# EAGLE board module_alu1_ctrl (EAGLE 6.5.0)
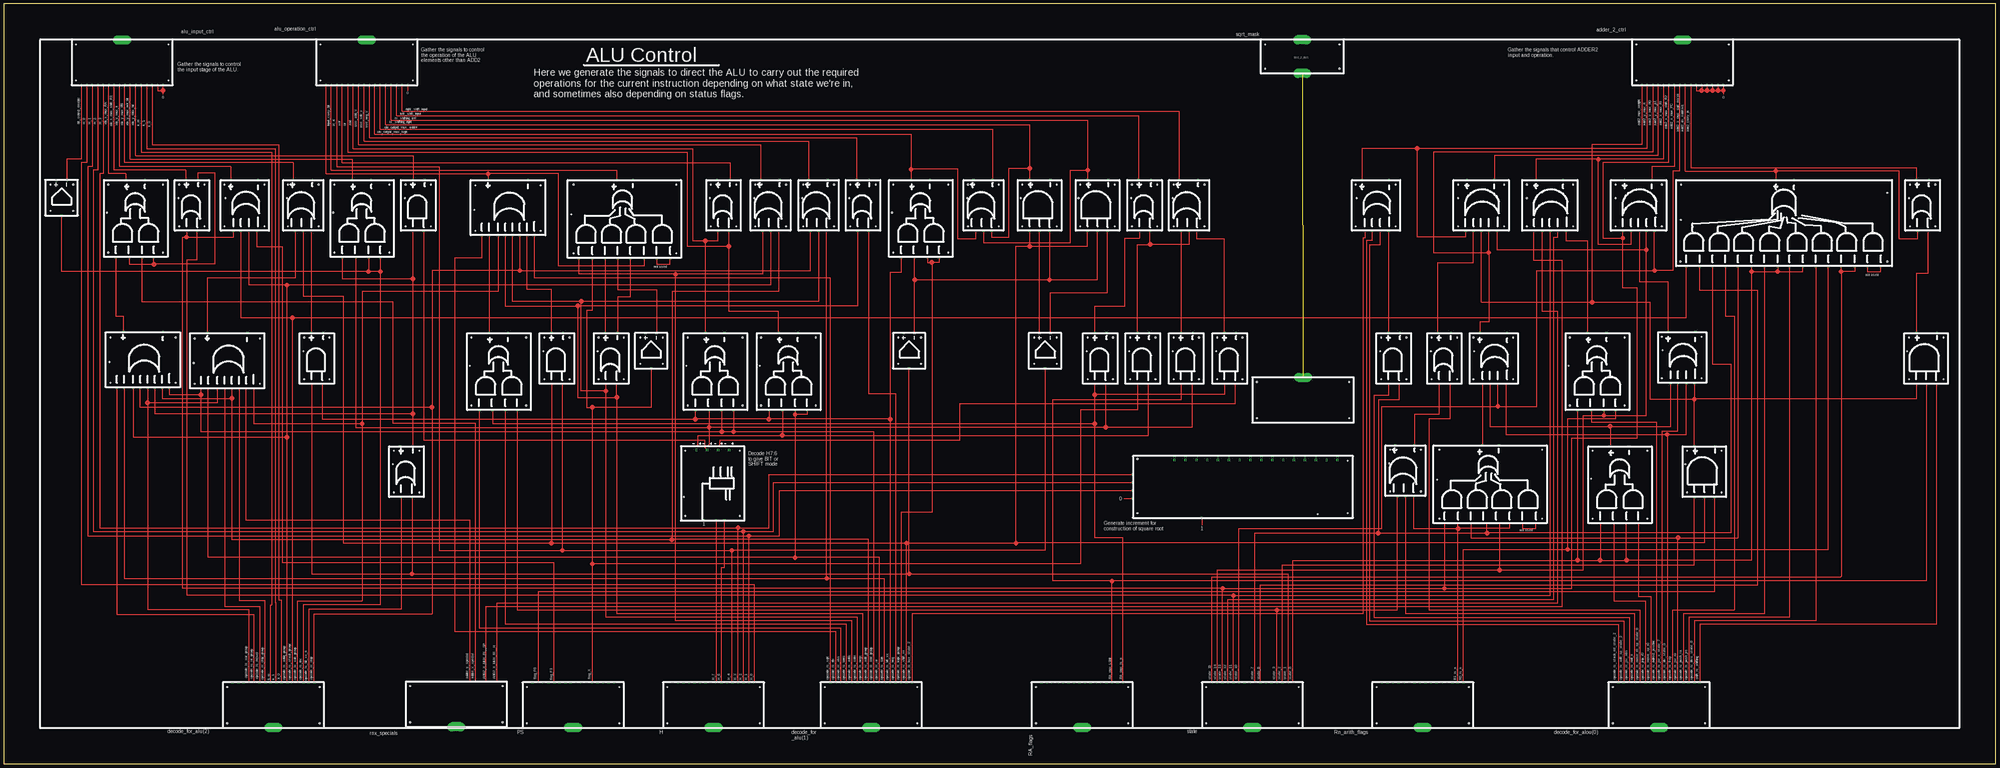
[diagram p14: board, top side]
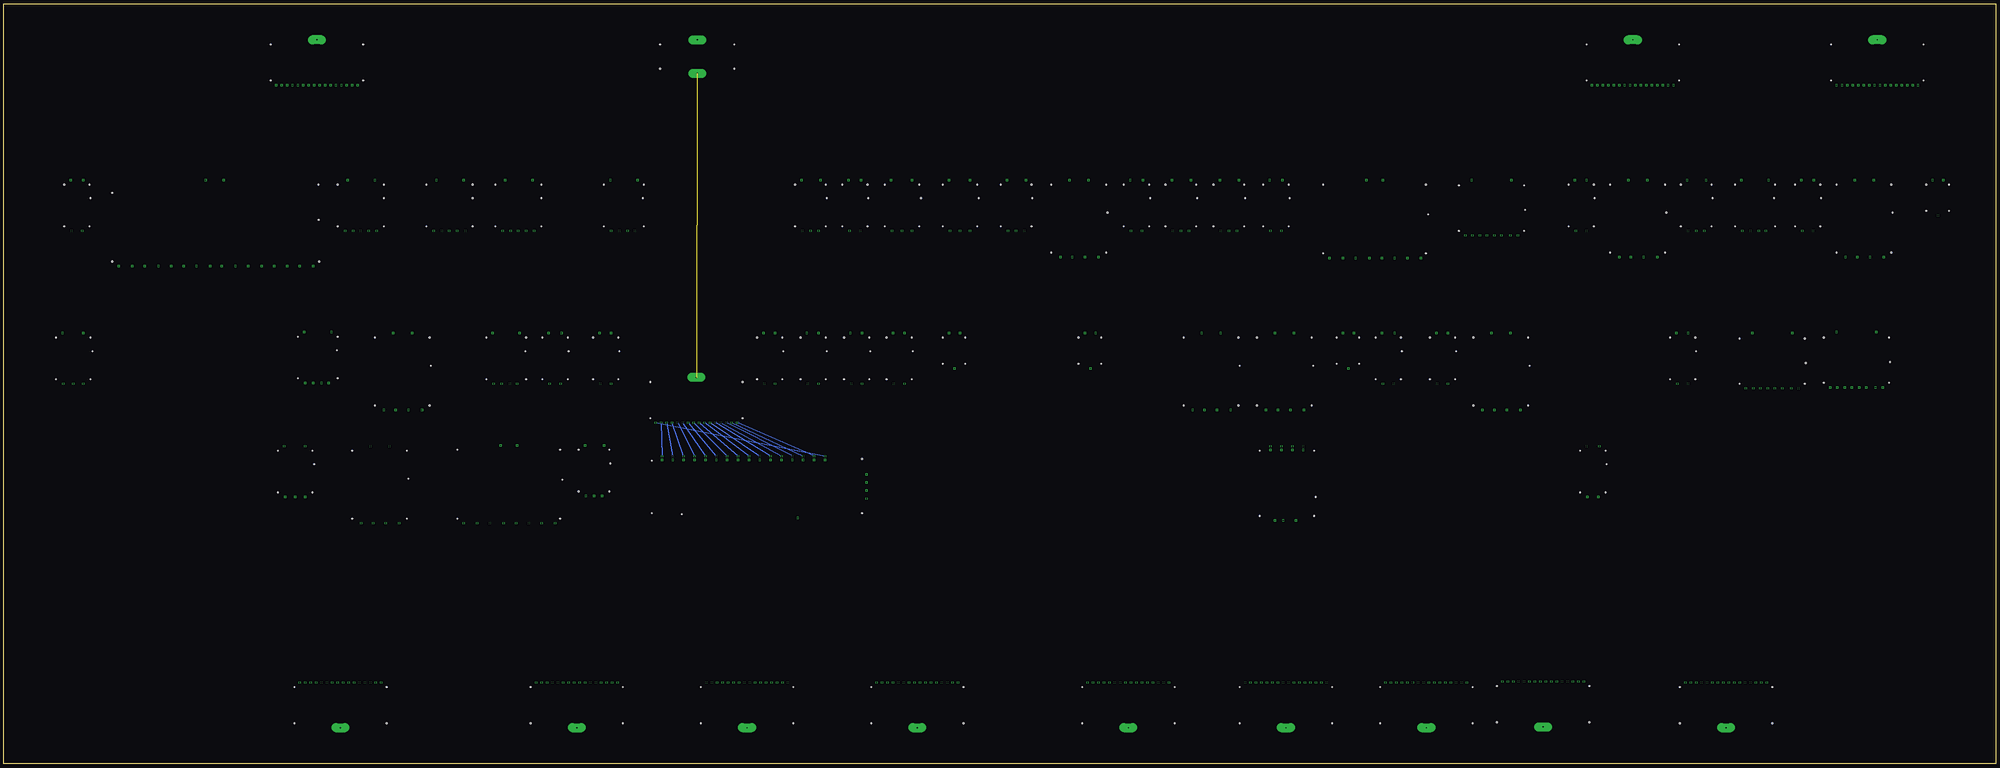
[diagram p15: board, bottom side, seen from below]

Size 1397 x 533.4 mm. Coordinates in mm from the lower left corner, seen from the top.
Outline: 0,0 1397,0 1397,533.4 0,533.4 0,0
Copper layers (1*16): Top 0.035mm / dielectric 1.5mm / Bottom 0.035mm
Design rules "default": minimum track width 10mil, minimum drill 24mil, track to track 8mil, track to pad 8mil, pad to pad 8mil, via to via 8mil, smd to smd 8mil, copper to edge 40mil, drill to drill 8mil, minimum pad ring 10mil, minimum via ring 8mil, stop-mask expansion 4mil, vias tented up to drill 0mil, thermal gap 10mil
tKeepout: area 16.3,16.3 to 34.5,34.5; area 689.4,16.3 to 707.6,34.5; area 1362.5,16.3 to 1380.7,34.5; area 1362.5,498.9 to 1380.7,517.1; area 689.4,498.9 to 707.6,517.1; area 16.3,498.9 to 34.5,517.1

## Footprints (pad centres in the part's own frame; a part is rotated, then mirrored left to right if it is on the bottom)
BUS_SPLIT_DISPLAY = drill 0.8 pad 6.452 long: INPUT 0,15.24 | drill 0.8 square: P$1 -28.575,-16.51; P$2 -24.765,-16.51; P$3 -20.955,-16.51; P$4 -17.145,-16.51; P$5 -13.335,-16.51; P$6 -9.525,-16.51; P$7 -5.715,-16.51; P$8 -1.905,-16.51; P$9 1.905,-16.51; P$10 5.715,-16.51; P$11 9.525,-16.51; P$12 13.335,-16.51; P$13 17.145,-16.51; P$14 20.955,-16.51; P$15 24.765,-16.51; P$16 28.575,-16.51 | hole 0.6: -32.385,-13.335; -32.385,12.065; 32.385,12.065; 32.385,-13.335
3OR = drill 0.8 square: OUT_M 16.51,-6.985; OUT_P 16.51,6.35; P$1 -19.05,-6.35; P$2 -19.05,-0.635; P$3 -19.05,5.08 | hole 0.6: -15.875,-11.43; 13.335,-11.43; 13.335,10.16; -15.875,10.16; 3.81,10.795
2AND = drill 0.8 square: OUT_M 19.05,-4.445; OUT_P 19.05,3.81; P$1 -16.51,-3.81; P$2 -16.51,3.81 | hole 0.6: -13.335,8.89; 15.875,-8.89; -13.335,-8.89; 15.875,8.89; 6.35,9.525
2X2AND_OR = drill 0.8 square: OUT_M 27.94,-6.985; OUT_P 27.94,6.35; P$1 -26.035,-13.335; P$2 -26.035,-5.08; P$3 -26.035,3.81; P$4 -26.035,13.335 | hole 0.6: -22.86,18.733; 24.765,18.733; -22.86,-19.685; 24.765,-19.685; 5.08,19.685
8OR = drill 0.8 square: 1 -21.59,-17.78; 2 -21.59,-12.7; 3 -21.59,-7.62; 4 -21.59,-2.54; 5 -21.59,2.54; 6 -21.59,7.62; 7 -21.59,13.97; 8 -21.59,19.05; OUT_M 17.145,-13.335; OUT_P 17.145,14.605 | hole 0.6: -18.415,-22.225; 13.335,-22.225; 13.335,23.495; -18.415,23.495; -3.81,24.13
2OR = drill 0.8 square: OUT_M 17.78,-4.445; OUT_P 17.78,4.445; P$1 -17.78,-3.81; P$2 -17.78,3.81 | hole 0.6: -14.605,8.89; 14.605,-8.89; 14.605,8.89; -14.605,-8.89; 5.08,9.525
4X2AND_OR = drill 0.8 square: OUT_M 26.67,-6.985; OUT_P 26.67,4.445; P$1 -27.94,-33.02; P$2 -27.94,-23.495; P$3 -27.94,-14.605; P$4 -27.94,-5.08; P$5 -27.94,3.81; P$6 -27.94,12.7; P$7 -27.94,21.59; P$8 -27.94,31.115 | hole 0.6: -24.765,-37.465; 23.495,-37.465; 23.495,34.608; -24.765,34.608; 2.54,36.195
DECODER4 = drill 0.8 square: A0 -24.765,-7.62; A1 -24.765,-1.905; E -24.765,6.985; N0 24.765,-10.795; N1 24.765,-3.175; N2 24.765,4.445; N3 24.765,12.065; P0 27.305,-10.795; P1 27.305,-3.175; P2 27.305,4.445; P3 27.305,12.065 | hole 0.6: 24.13,19.685; -21.59,19.685; -21.59,-18.415; 24.13,-18.415; -8.255,20.955
1BUF = drill 0.8 square: IN -12.7,0; N 12.065,-3.81; P 12.065,3.81 | hole 0.6: -9.525,7.62; -9.525,-8.255; 8.89,-8.255; 8.89,7.62
4OR = drill 0.8 square: 1 -16.51,-8.255; 2 -16.51,-2.54; 3 -16.51,3.175; 4 -16.51,8.255; OUT_M 19.05,-8.89; OUT_P 19.05,10.16 | hole 0.6: -13.335,-13.335; 15.875,-13.335; 15.875,14.605; -13.335,14.605; 6.35,13.97
DECODER16 = drill 0.8 square: A0 -83.82,-8.255; A1 -83.82,-2.54; A2 -83.82,3.175; A3 -83.82,8.89; E -35.56,-21.59; N0 59.69,19.05; N1 52.07,19.05; N2 44.45,19.05; N3 36.83,19.05; N4 29.21,19.05; N5 21.59,19.05; N6 13.97,19.05; N7 6.35,19.05; N8 -1.27,19.05; N9 -8.89,19.05; N10 -16.51,19.05; N11 -24.13,19.05; N12 -31.75,19.05; N13 -39.37,19.05; N14 -46.99,19.05; N15 -54.61,19.05; P0 59.69,21.59; P1 52.07,21.59; P2 44.45,21.59; P3 36.83,21.59; P4 29.21,21.59; P5 21.59,21.59; P6 13.97,21.59; P7 6.35,21.59; P8 -1.27,21.59; P9 -8.89,21.59; P10 -16.51,21.59; P11 -24.13,21.59; P12 -31.75,21.59; P13 -39.37,21.59; P14 -46.99,21.59; P15 -54.61,21.59 | hole 0.6: 66.675,18.415; -80.645,19.685; -80.645,-18.415; 66.675,-18.415; 45.72,-19.05
3AND = drill 0.8 square: OUT_M 16.51,-7.62; OUT_P 16.51,6.985; P$1 -19.05,-6.985; P$2 -19.05,0; P$3 -19.05,6.985 | hole 0.6: -15.875,-12.065; 13.335,-12.065; 13.335,12.065; -15.875,12.065; 3.81,13.335
BUS2BUS = drill 0.8 pad 6.452 long: P$1 -1.27,12.7; P$2 -1.27,-10.795 | hole 0.6: -27.305,-7.62; -27.305,9.525; 24.765,9.525; 24.765,-7.62
5OR = drill 0.8 square: 1 -17.78,-10.795; 2 -17.78,-5.08; 3 -17.78,0; 4 -17.78,5.715; 5 -17.78,11.43; OUT_M 17.78,-8.89; OUT_P 17.78,10.16 | hole 0.6: -14.605,-15.875; 14.605,-15.875; 14.605,16.51; -14.605,16.51; 5.08,16.51
8X2AND_OR = drill 0.8 square: OUT_M 29.845,-8.89; OUT_P 29.845,3.81; P$1 -30.48,-69.85; P$2 -30.48,-60.325; P$3 -30.48,-51.435; P$4 -30.48,-41.91; P$5 -30.48,-33.02; P$6 -30.48,-24.13; P$7 -30.48,-15.24; P$8 -30.48,-5.715; P$9 -30.48,2.54; P$10 -30.48,12.065; P$11 -30.48,20.955; P$12 -30.48,30.48; P$13 -30.48,39.37; P$14 -30.48,48.26; P$15 -30.48,57.15; P$16 -30.48,66.675 | hole 0.6: -27.305,-74.295; 20.955,-74.295; 26.67,70.168; -27.305,70.802; 1.905,70.485

## Placement (x,y rotation side)
CMP1  BUS_SPLIT_DISPLAY  [BUS_SPLIT_DISPLAY]  995.04,40.64 180 top
CMP2  3OR  [3OR]  537.21,393.06 90 top
CMP3  2AND  [2AND]  387.99,283.21 90 top
CMP4  2X2AND_OR  [2X2AND_OR]  346.71,274.32 90 top
CMP5  8OR  [8OR]  354.33,392.43 90 top
CMP6  2OR  [2OR]  426.08,284.48 90 top
CMP7  4X2AND_OR  [4X2AND_OR]  434.34,382.9 90 top
CMP8  3OR  [3OR]  570.87,393.06 90 top
CMP9  2OR  [2OR]  602.62,391.8 90 top
CMP10  DECODER4  [DECODER4]  497.84,195.58 90 top
CMP11  2AND  [2AND]  798.83,283.21 90 top
CMP12  BUS_SPLIT_DISPLAY  [BUS_SPLIT_DISPLAY]  875.66,40.64 180 top
CMP13  BUS_SPLIT_DISPLAY  [BUS_SPLIT_DISPLAY]  497.84,40.64 180 top
CMP14  2X2AND_OR  [2X2AND_OR]  1116.96,274.32 90 top
CMP15  BUS_SPLIT_DISPLAY  [BUS_SPLIT_DISPLAY]  756.28,40.64 180 top
CMP16  2AND  [2AND]  768.99,283.21 90 top
CMP17  3OR  [3OR]  982.35,207.01 90 top
CMP18  2OR  [2OR]  800.1,391.8 90 top
CMP19  2AND  [2AND]  859.79,283.21 90 top
CMP20  2AND  [2AND]  219.71,283.21 90 top
CMP21  BUS_SPLIT_DISPLAY  [BUS_SPLIT_DISPLAY]  399.42,40.64 180 top
CMP22  BUS_SPLIT_DISPLAY  [BUS_SPLIT_DISPLAY]  317.5,41.27 180 top
CMP23  2AND  [2AND]  829.31,283.21 90 top
CMP24  2OR  [2OR]  282.57,205.1 90 top
CMP25  1BUF  [1BUF]  635,290.19 90 top
CMP26  8OR  [8OR]  98.42,285.75 90 top
CMP27  2OR  [2OR]  132.08,391.8 90 top
CMP28  2X2AND_OR  [2X2AND_OR]  92.08,381.63 90 top
CMP29  8OR  [8OR]  157.48,285.12 90 top
CMP30  3OR  [3OR]  209.55,393.06 90 top
CMP31  4OR  [4OR]  169.54,390.52 90 top
CMP32  2AND  [2AND]  290.83,390.52 90 top
CMP33  2X2AND_OR  [2X2AND_OR]  250.82,381.63 90 top
CMP34  3OR  [3OR]  830.58,393.06 90 top
CMP35  DECODER16  [DECODER16]  875.66,194.31 0 top
CMP36  3AND  [3AND]  767.08,393.06 90 top
CMP37  3AND  [3AND]  726.44,393.06 90 top
CMP38  1BUF  [1BUF]  730.25,290.19 90 top
CMP39  BUS_CONSTRUCT_DISPLAY  [BUS_SPLIT_DISPLAY]  911.23,255.91 0 top
CMP40  BUS_2_BUS  [BUS2BUS]  909.32,497.2 180 top
CMP41  1BUF  [1BUF]  40.64,397.51 90 top
CMP42  2X2AND_OR  [2X2AND_OR]  498.48,274.32 90 top
CMP43  2X2AND_OR  [2X2AND_OR]  549.91,274.32 90 top
CMP44  2OR  [2OR]  504.82,391.8 90 top
CMP45  2X2AND_OR  [2X2AND_OR]  642.62,381.63 90 top
CMP46  3OR  [3OR]  686.43,393.06 90 top
CMP47  2AND  [2AND]  974.73,283.21 90 top
CMP48  2X2AND_OR  [2X2AND_OR]  1132.84,194.94 90 top
CMP49  4OR  [4OR]  962.66,390.52 90 top
CMP50  4OR  [4OR]  1045.21,283.21 90 top
CMP51  2OR  [2OR]  1010.28,284.48 90 top
CMP52  4X2AND_OR  [4X2AND_OR]  1041.4,196.85 90 top
CMP53  4OR  [4OR]  1177.29,283.85 90 top
CMP54  5OR  [5OR]  1036.32,391.8 90 top
CMP55  8X2AND_OR  [8X2AND_OR]  1246.51,379.73 90 top
CMP56  3AND  [3AND]  1192.53,206.38 90 top
CMP57  1BUF  [1BUF]  454.02,290.19 90 top
CMP59  3AND  [3AND]  1348.11,285.75 90 top
CMP60  5OR  [5OR]  1084.58,391.8 90 top
CMP61  2OR  [2OR]  1345.57,391.8 90 top
CMP62  5OR  [5OR]  1146.81,391.8 90 top
CMP65  BUS_CONSTRUCT_DISPLAY  [BUS_SPLIT_DISPLAY]  254.63,492.76 0 top
CMP66  BUS_CONSTRUCT_DISPLAY  [BUS_SPLIT_DISPLAY]  83.19,492.76 0 top
CMP67  BUS_CONSTRUCT_DISPLAY  [BUS_SPLIT_DISPLAY]  1177.29,492.76 0 top
CMP88  BUS_SPLIT_DISPLAY  [BUS_SPLIT_DISPLAY]  608.33,40.64 180 top
CMP92  BUS_SPLIT_DISPLAY  [BUS_SPLIT_DISPLAY]  1160.78,40.64 180 top
CMP94  BUS_SPLIT_DISPLAY  [BUS_SPLIT_DISPLAY]  189.23,40.64 180 top

## Tracks (layer width: path | path; a pad name or v marks a point on that pad's centre or on a via)
ADD1_CARRY_INPUT_BIT
  Top 0.61: CMP7.OUT_P 429.89,416.56 229.87,416.56 CMP65.P$2
ADD1_DO_SUBTRACT
  Top 0.61: 339.73,414.02 226.06,414.02 CMP65.P$1 | 339.73,414.02 CMP5.OUT_P | CMP7.P$3 448.94,349.25 389.25,349.25 389.25,414.02 339.73,414.02
ADD2_CARRY_IN
  Top 0.61: CMP61.OUT_P 1341.12,418.46 1183.01,418.46 CMP67.P$10
ADD2_DO_SUBTRACT
  Top 0.61: 1242.69,415.93 1179.19,415.93 CMP67.P$9 | 1242.69,415.93 CMP55.OUT_P | CMP61.P$2 1341.76,368.3 1329.06,368.3 1329.06,415.93 1242.69,415.93
ADD2_MUX_WEIGHT
  Top 0.61: CMP56.OUT_P 1185.55,255.91 | CMP54.3 1036.32,323.85 1113.79,323.85 | CMP59.P$3 1341.12,255.91 1185.55,255.91 | CMP53.1 1185.55,255.91 | 1113.79,323.85 1154.43,323.85 1154.43,255.91 1185.55,255.91 | CMP67.P$1 1148.71,434.34 1113.79,434.34 1113.79,323.85
ADD2_WEIGHT_BIT
  Top 0.61: CMP61.P$1 1349.38,344.17 1341.12,344.17 CMP59.OUT_P
ADD2_X_MUX_PC
  Top 0.61: CMP62.OUT_M 1155.7,419.1 1171.58,419.1 CMP67.P$7
ADD2_X_MUX_RI
  Top 0.61: 1118.23,424.18 1163.95,424.18 CMP67.P$5 | 1118.23,424.18 1074.42,424.18 CMP60.OUT_P | CMP62.4 1141.1,364.49 1118.23,364.49 1118.23,424.18
ADD2_X_MUX_RI__H
  Top 0.61: CMP22.P$1 346.07,113.03 1089.66,113.03 1089.66,317.5 1078.87,317.5 CMP60.4
ADD2_X_MUX_RI__SET_A
  Top 0.61: CMP60.1 1095.38,367.03 1110.62,367.03 CMP14.OUT_P
ADD2_X_MUX_RI__SP
  Top 0.61: CMP22.P$3 338.45,110.49 1092.84,110.49 1092.84,353.06 1073.15,353.06 CMP60.5
ADD2_X_ZERO
  Top 0.61: CMP62.3 1146.81,338.45 1167.13,338.45 CMP53.OUT_P
ADD2_Y_MUX_0
  Top 0.61: CMP51.OUT_P 1005.84,351.79 1030.61,351.79 CMP54.4
ADD2_Y_MUX_0__MUL
  Top 0.61: CMP51.P$2 1006.48,245.11 989.33,245.11 CMP17.OUT_M
ADD2_Y_MUX_H
  Top 0.61: 991.24,431.8 1152.53,431.8 CMP67.P$2 | 991.24,431.8 952.5,431.8 CMP49.OUT_P | CMP54.5 1024.89,369.57 991.24,369.57 991.24,431.8
ADD2_Y_MUX_H__JSR
  Top 0.61: CMP49.1 CMP47.OUT_P
ADD2_Y_MUX_P1
  Top 0.61: CMP54.OUT_M 1045.21,426.72 1160.14,426.72 CMP67.P$4
ADD2_Y_MUX_R0
  Top 0.61: 1041.4,358.77 1002.66,358.77 1002.66,429.26 1156.34,429.26 CMP67.P$3 | 1041.4,358.77 CMP54.2 | 1041.4,358.77 1041.4,309.88 1035.05,309.88 CMP50.OUT_P
ADD2_Y_MUX_R0__SET_A
  Top 0.61: CMP50.4 CMP52.OUT_P
ADDER_X_SPECIAL
  Top 0.61: CMP22.P$5 330.83,238.76 273.05,238.76 273.05,323.85 97.16,323.85 CMP28.P$2
ADDER_Y_SPECIAL
  Top 0.61: CMP22.P$6 327.02,170.81 170.18,170.81 CMP29.2
ALU1_OUTPUT_MUX_ADDER
  Top 0.61: CMP46.OUT_M 693.42,445.13 264.16,445.13 CMP65.P$11
ALU1_OUTPUT_MUX_LOGIC
  Top 0.61: 636.27,417.19 636.27,441.96 260.35,441.96 CMP65.P$10 | 636.27,417.19 CMP45.OUT_P | CMP46.P$3 681.36,368.3 669.29,368.3 669.29,417.19 636.27,417.19
ALU1_X_MUX_RA
  Top 0.61: CMP28.OUT_P 85.72,414.02 73.66,414.02 CMP66.P$6
ALU1_X_MUX_RA__SET_A
  Top 0.61: CMP28.P$4 78.74,314.32 83.82,314.32 CMP26.OUT_P
ALU1_X_MUX_SHIFT_R3
  Top 0.61: CMP27.OUT_P 127.64,416.56 77.47,416.56 CMP66.P$7
ALU1_X_MUX_SHIFT_R3_N
  Top 0.61: CMP27.OUT_M 136.53,414.65 147.96,414.65 147.96,350.52 105.41,350.52 | 105.41,350.52 CMP28.P$1 | CMP28.P$3 88.27,350.52 105.41,350.52
ALU1_Y_MUX_BIT
  Top 0.61: CMP32.OUT_P 287.02,426.72 92.71,426.72 CMP66.P$11
ALU1_Y_MUX_K
  Top 0.61: CMP31.OUT_P 159.38,419.1 81.28,419.1 CMP66.P$8
ALU1_Y_MUX_NOT_BIT
  Top 0.61: CMP33.OUT_P 244.47,424.18 88.9,424.18 CMP66.P$10
ALU1_Y_MUX_RB
  Top 0.61: CMP30.OUT_P 203.2,421.64 85.09,421.64 CMP66.P$9
ALU1_Y_MUX_RB_A
  Top 0.61: CMP30.P$3 204.47,341 142.88,341 CMP29.OUT_P
AND
  Top 0.61: 492.12,367.03 483.24,367.03 483.24,431.8 245.11,431.8 CMP65.P$6 | 492.12,367.03 501.01,367.03 CMP44.P$2 | CMP42.OUT_P 492.12,367.03
ARITH_RIGHT_INPUT
  Top 0.61: CMP19.OUT_P 855.98,368.3 836.93,368.3 CMP34.P$1
BIT_SELECT_ENABLE
  Top 0.61: CMP41.N 44.45,424.18 54.61,424.18 CMP66.P$1
BIT_SHIFT_MODE_CHANGE__ARITH
  Top 0.61: CMP10.P1 502.29,224.16 502.29,227.33 670.56,227.33 670.56,252.73 863.6,252.73 CMP19.P$1
BIT_SHIFT_MODE_CLEAR__ROTATE
  Top 0.61: CMP42.P$3 494.67,236.22 | 494.67,236.22 494.67,224.16 CMP10.P2 | CMP16.P$1 772.79,236.22 | 772.79,236.22 494.67,236.22 | CMP23.P$1 833.12,236.22 772.79,236.22 | CMP33.P$3 247.01,236.22 494.67,236.22
BIT_SHIFT_MODE_CLEAR__ROTATE_N
  Top 0.61: CMP10.N2 491.49,222.25 491.49,227.33 294.64,227.33 CMP32.P$1
BIT_SHIFT_MODE_SET__X_ROT
  Top 0.61: CMP10.P3 487.05,224.16 487.05,230.5 546.1,230.5 | 546.1,230.5 802.64,230.5 CMP11.P$1 | CMP43.P$3 546.1,230.5
BIT_XX_ACTION_CYCLE
  Top 0.61: CMP24.OUT_M 287.02,245.75 | 287.02,245.75 287.02,340.36 | 287.02,340.36 CMP32.P$2 | CMP26.3 106.05,245.75 287.02,245.75 | CMP33.P$4 237.49,340.36 287.02,340.36
BIT_XX_LOAD_CYCLE
  Top 0.61: CMP20.OUT_P CMP30.P$1
DO_SUBTRACT__SET_A
  Top 0.61: CMP5.7 CMP4.OUT_P
FLAG_F3
  Top 0.61: CMP21.P$12 386.08,140.97 195.58,140.97 195.58,362.58 177.8,362.58 CMP31.1
FLAG_F6
  Top 0.61: CMP56.P$1 1199.52,120.65 374.65,120.65 CMP21.P$15
FLAG_X
  Top 0.61: CMP7.P$7 412.75,318.13 408.94,318.13 408.94,250.19 412.75,250.19 | 412.75,250.19 412.75,140.34 | 412.75,140.34 CMP21.P$5 | CMP11.P$2 795.02,248.28 755.01,248.28 755.01,140.34 412.75,140.34 | CMP57.IN 454.02,250.19 412.75,250.19
FLAG_X_N
  Top 0.61: CMP7.P$5 430.53,332.74 457.83,332.74 CMP57.N
H_0
  Top 0.61: CMP66.P$2 58.42,421.64 54.61,421.64 54.61,125.73 526.41,125.73 CMP13.P$1
H_1
  Top 0.61: CMP66.P$3 62.23,419.1 59.05,419.1 59.05,160.02 522.61,160.02 | 522.61,160.02 544.2,160.02 544.2,191.77 CMP35.A1 | CMP13.P$2 522.61,160.02
H_2
  Top 0.61: CMP66.P$4 66.04,416.56 62.87,416.56 62.87,163.19 518.79,163.19 | 518.79,163.19 539.75,163.19 539.75,197.49 CMP35.A2 | CMP13.P$3 518.79,163.19
H_3
  Top 0.61: CMP66.P$5 69.85,414.02 67.31,414.02 67.31,165.74 514.99,165.74 | 514.99,165.74 536.58,165.74 536.58,203.2 CMP35.A3 | CMP13.P$4 514.99,165.74
H_4
  Top 0.61: CMP38.IN 730.25,149.86 510.54,149.86 | 510.54,149.86 510.54,57.78 CMP13.P$5 | CMP3.P$1 391.8,149.86 | 391.8,149.86 510.54,149.86 | CMP65.P$3 233.68,419.1 305.44,419.1 305.44,149.86 391.8,149.86
H_6
  Top 0.61: CMP13.P$7 503.56,137.79 505.46,137.79 CMP10.A0
H_7
  Top 0.61: CMP10.A1 CMP13.P$8
IS_SHIFTING_LEFT
  Top 0.61: 760.1,416.56 760.1,451.49 271.78,451.49 CMP65.P$13 | 760.1,416.56 CMP36.OUT_P | CMP46.P$2 687.07,365.76 748.03,365.76 748.03,416.56 760.1,416.56
IS_SHIFTING_RIGHT
  Top 0.61: 719.46,417.83 719.46,448.31 267.97,448.31 CMP65.P$12 | 719.46,417.83 CMP37.OUT_P | CMP46.P$1 692.78,369.57 704.85,369.57 704.85,417.83 719.46,417.83
JMP_R0_MOVE_SP_R0_STATE_0
  Top 0.61: CMP50.3 1042.04,236.85 1126.49,236.85 | 1126.49,236.85 CMP48.OUT_P | 1126.49,236.85 1169.04,236.85 CMP53.4
K_0
  Top 0.61: CMP66.P$14 104.14,434.34 193.04,434.34 193.04,114.94 194.94,114.94 CMP94.P$7
K_1
  Top 0.61: CMP66.P$13 100.33,431.8 190.5,431.8 190.5,113.03 191.13,113.03 CMP94.P$8
K_N
  Top 0.61: CMP66.P$12 96.52,429.26 187.96,429.26 187.96,111.76 187.32,111.76 CMP94.P$9
LEFT_SHIFT_INPUT
  Top 0.61: CMP18.OUT_P 795.65,454.66 275.59,454.66 CMP65.P$14
N$1
  Top 0.61: CMP7.P$2 457.83,350.52 467.36,350.52 CMP7.P$1
N$2
  Top 0.61: CMP35.E 840.11,167.64
N$4
  Bottom 0.254: CMP39.P$15 CMP35.P0
N$5
  Bottom 0.254: CMP39.P$14 CMP35.P1
N$6
  Bottom 0.254: CMP35.P2 CMP39.P$13
N$7
  Top 0.61: CMP35.A0 785.5,186.06
N$8
  Bottom 0.254: CMP39.P$12 CMP35.P3
N$9
  Bottom 0.254: CMP35.P4 CMP39.P$11
N$10
  Bottom 0.254: CMP39.P$10 CMP35.P5
N$11
  Bottom 0.254: CMP35.P6 CMP39.P$9
N$12
  Bottom 0.254: CMP39.P$8 CMP35.P7
N$13
  Bottom 0.254: CMP35.P8 CMP39.P$7
N$14
  Bottom 0.254: CMP39.P$6 CMP35.P9
N$15
  Bottom 0.254: CMP35.P10 CMP39.P$5
N$16
  Bottom 0.254: CMP39.P$4 CMP35.P11
N$17
  Bottom 0.254: CMP35.P12 CMP39.P$3
N$18
  Bottom 0.254: CMP39.P$2 CMP35.P13
N$19
  Bottom 0.254: CMP35.P14 CMP39.P$1
N$20
  Bottom 0.254: CMP39.P$16 CMP35.P15
N$21  (1 unrouted)
N$22
  Top 0.61: CMP66.P$16 111.76,472.44 | 111.76,472.44 111.76,469.9 | CMP66.P$15 107.95,472.44 111.76,472.44
N$24
  Top 0.61: CMP67.P$16 1205.87,472.44 | 1205.87,472.44 1205.87,469.9 | CMP67.P$11 1186.82,472.44 1190.62,472.44 | 1190.62,472.44 1194.43,472.44 | 1194.43,472.44 1198.24,472.44 | 1198.24,472.44 1202.06,472.44 | 1202.06,472.44 1205.87,472.44 | CMP67.P$15 1202.06,472.44 | CMP67.P$14 1198.24,472.44 | CMP67.P$13 1194.43,472.44 | CMP67.P$12 1190.62,472.44
N$25
  Top 0.61: 283.21,474.98 283.21,472.44
N$31
  Top 0.61: CMP55.P$2 1306.83,345.44 1316.36,345.44 CMP55.P$1
N$32
  Top 0.61: CMP52.P$2 1064.89,165.1 1074.42,165.1 CMP52.P$1
NEGATE_FOR_SHIFT
  Top 0.61: CMP3.OUT_P 384.18,332.74 367.03,332.74 CMP5.2
OPCODE_IS_ABS
  Top 0.61: CMP4.P$4 333.38,95.25 587.38,95.25 CMP88.P$14
OPCODE_IS_ADD_GROUP
  Top 0.61: CMP26.2 111.12,256.54 160.02,256.54 | CMP29.4 160.02,256.54 | 160.02,256.54 160.02,157.48 468.63,157.48 | CMP2.P$1 543.56,331.47 468.63,331.47 468.63,157.48 | CMP88.P$9 606.42,157.48 468.63,157.48
OPCODE_IS_ADD_SP_STATE_2
  Top 0.61: CMP49.2 965.2,363.86 957.58,363.86 957.58,100.33 1136.02,100.33 CMP92.P$15
OPCODE_IS_ADDQ_GROUP
  Top 0.61: CMP2.P$2 537.85,335.92 198.75,335.92 | 198.75,335.92 172.09,335.92 CMP31.2 | CMP26.6 90.81,229.24 198.75,229.24 | 198.75,229.24 198.75,335.92 | CMP94.P$6 198.75,229.24
OPCODE_IS_ADDX
  Top 0.61: CMP7.P$8 403.23,343.54 471.17,343.54 | CMP2.P$3 532.13,343.54 471.17,343.54 | CMP88.P$12 595,100.33 471.17,100.33 471.17,343.54
OPCODE_IS_AND_GROUP
  Top 0.61: CMP42.P$2 503.56,233.04 | 503.56,233.04 138.43,233.04 138.43,259.08 | 138.43,259.08 CMP29.8 | CMP26.1 116.2,259.08 138.43,259.08 | CMP88.P$8 610.24,233.04 511.81,233.04 | 511.81,233.04 503.56,233.04 | CMP42.P$1 511.81,233.04
OPCODE_IS_BIT_XX
  Top 0.61: CMP43.P$4 536.58,241.94 | 536.58,241.94 485.14,241.94 | 485.14,241.94 CMP42.P$4 | CMP45.P$4 629.28,344.81 621.66,344.81 621.66,241.94 | 621.66,241.94 536.58,241.94 | CMP20.P$1 223.52,241.94 485.14,241.94 | 621.66,241.94 CMP88.P$5
OPCODE_IS_BIT_XX_N
  Top 0.61: CMP24.P$2 278.76,108.58 214,108.58 CMP94.P$2
OPCODE_IS_BXX_STATE_2
  Top 0.61: CMP49.4 954.4,368.94 953.13,368.94 953.13,105.41 636.9,105.41 CMP88.P$1
OPCODE_IS_CMP
  Top 0.61: CMP5.3 361.95,346.07 | 361.95,346.07 565.78,346.07 CMP8.P$3 | 361.95,346.07 300.36,346.07 300.36,250.19 | 300.36,250.19 95.89,250.19 CMP26.5 | 300.36,250.19 300.36,105.41 217.81,105.41 CMP94.P$1
OPCODE_IS_CMP_GROUP
  Top 0.61: CMP29.3 165.1,114.3 183.51,114.3 CMP94.P$10
OPCODE_IS_DIV
  Top 0.61: CMP5.8 335.28,354.96 316.23,354.96 316.23,92.71 583.57,92.71 CMP88.P$15
OPCODE_IS_DIV_STATE_0
  Top 0.61: 1166.49,231.14 CMP92.P$7 | CMP50.1 1053.46,231.14 1166.49,231.14 | 1166.49,231.14 1179.83,231.14 CMP53.2
OPCODE_IS_DIVS_STATE_0
  Top 0.61: CMP55.P$6 1270.63,100.33 1185.55,100.33 CMP92.P$2
OPCODE_IS_INDIRECT_POSTINC
  Top 0.61: CMP14.P$3 1113.15,240.03 1158.88,240.03 CMP92.P$9
OPCODE_IS_INV
  Top 0.61: CMP33.P$2 255.91,345.44 | 255.91,345.44 40.64,345.44 CMP41.IN | CMP33.P$1 264.16,345.44 | 264.16,345.44 255.91,345.44 | 264.16,345.44 264.16,111.76 210.19,111.76 CMP94.P$3
OPCODE_IS_JMP_R0
  Top 0.61: CMP48.P$3 1129.03,114.3 1151.26,114.3 CMP92.P$11
OPCODE_IS_JSR_ABS
  Top 0.61: CMP47.P$2 970.91,258.44 960.75,258.44 960.75,102.87 1139.83,102.87 CMP92.P$14
OPCODE_IS_JSR_R0
  Top 0.61: CMP55.P$12 1216.03,158.75 1174.12,158.75 | CMP52.P$6 1028.7,158.75 1174.12,158.75 | CMP92.P$5 1174.12,158.75
OPCODE_IS_JSR_X_STATE_7
  Top 0.61: CMP92.P$8 1162.68,233.68 1174.12,233.68 CMP53.3
OPCODE_IS_LOGIC_GROUP
  Top 0.61: CMP45.P$2 647.7,351.79 650.88,351.79 | 650.88,351.79 650.88,176.53 629.28,176.53 CMP88.P$3 | CMP45.P$1 655.96,351.79 650.88,351.79
OPCODE_IS_MOVE_R0_SP_STATE_0
  Top 0.61: CMP51.P$1 1014.1,241.94 999.49,241.94 999.49,107.95 1147.44,107.95 CMP92.P$12
OPCODE_IS_MOVE_SP_R0
  Top 0.61: CMP48.P$1 1146.17,117.47 1155.07,117.47 CMP92.P$10
OPCODE_IS_MOVER
  Top 0.61: CMP29.5 154.94,110.49 179.71,110.49 CMP94.P$11
OPCODE_IS_MUL_N
  Top 0.61: CMP17.P$2 982.98,105.41 1143.63,105.41 CMP92.P$13
OPCODE_IS_MULS
  Top 0.61: CMP4.P$2 351.79,97.79 591.18,97.79 CMP88.P$13
OPCODE_IS_NEG
  Top 0.61: CMP9.P$1 606.42,259.71 625.48,259.71 CMP88.P$4
OPCODE_IS_NEGX
  Top 0.61: CMP5.5 351.79,321.31 402.59,321.31 | 402.59,321.31 402.59,257.18 429.89,257.18 | 429.89,257.18 CMP6.P$1 | CMP9.P$2 598.8,321.31 402.59,321.31 | 429.89,257.18 429.89,105.41 602.62,105.41 CMP88.P$10
OPCODE_IS_OR
  Top 0.61: CMP43.P$2 554.99,245.11 | 554.99,245.11 554.99,144.78 | 554.99,144.78 143.51,144.78 CMP29.7 | CMP43.P$1 563.25,245.11 554.99,245.11 | CMP88.P$7 614.04,144.78 554.99,144.78
OPCODE_IS_OR_GROUP
  Top 0.61: CMP26.8 79.38,104.78 175.9,104.78 CMP94.P$12
OPCODE_IS_PUSH_PS
  Top 0.61: CMP55.P$8 1252.22,102.87 1181.73,102.87 CMP92.P$3
OPCODE_IS_PUSH_RA
  Top 0.61: CMP55.P$10 1234.44,105.41 1177.92,105.41 CMP92.P$4
OPCODE_IS_SHIFT_XX
  Top 0.61: CMP37.P$3 719.46,363.22 | 719.46,363.22 760.1,363.22 CMP36.P$3 | 709.93,154.94 709.93,363.22 719.46,363.22 | CMP56.P$2 1192.53,154.94 709.93,154.94 | CMP88.P$2 633.1,154.94 | 633.1,154.94 709.93,154.94 | CMP3.P$2 384.18,154.94 | 384.18,154.94 633.1,154.94 | CMP30.P$2 210.19,328.3 238.12,328.3 238.12,154.94 384.18,154.94
OPCODE_IS_SQRT
  Top 0.61: CMP5.1 372.11,341 579.75,341 CMP88.P$16
OPCODE_IS_STACK_GROUP
  Top 0.61: CMP31.3 166.37,313.06 202.56,313.06 | 202.56,313.06 1179.83,313.06 CMP55.P$16 | CMP94.P$5 202.56,313.06
OPCODE_IS_STACK_REL_STATE_2
  Top 0.61: CMP49.3 959.49,367.03 955.67,367.03 955.67,97.79 1132.2,97.79 CMP92.P$16
OPCODE_IS_SUB
  Top 0.61: CMP26.7 84.45,130.18 577.22,130.18 | 577.22,130.18 CMP8.P$1 | 577.22,130.18 617.86,130.18 CMP88.P$6
OPCODE_IS_SUB_GROUP
  Top 0.61: CMP5.6 346.71,331.47 251.46,331.47 251.46,238.76 | CMP29.1 175.26,238.76 251.46,238.76 | 251.46,238.76 251.46,114.3 206.38,114.3 CMP94.P$4
OPCODE_IS_SUBX
  Top 0.61: CMP6.P$2 422.27,261.62 | 422.27,261.62 405.13,261.62 405.13,324.49 | 405.13,324.49 356.87,324.49 CMP5.4 | CMP8.P$2 571.5,324.49 405.13,324.49 | 422.27,261.62 422.27,102.87 598.8,102.87 CMP88.P$11
OPCODE_IS_SUBX_NEGX
  Top 0.61: CMP7.P$6 CMP6.OUT_P
OPCODE_IS_SUBX_NEGX_N
  Top 0.61: CMP7.P$4 439.42,327.66 430.53,327.66 CMP6.OUT_M
OPCODE_IS_TRAP
  Top 0.61: CMP55.P$13 1207.13,314.32 1213.48,314.32 1213.48,107.95 1170.31,107.95 CMP92.P$6
OPCODE_IS_XOR_GROUP
  Top 0.61: CMP26.4 100.97,253.37 | 100.97,253.37 100.97,107.95 172.09,107.95 CMP94.P$13 | CMP29.6 149.86,253.37 100.97,253.37
OR
  Top 0.61: 508.63,363.22 479.43,363.22 479.43,429.26 241.3,429.26 CMP65.P$5 | 508.63,363.22 CMP44.P$1 | CMP43.OUT_P 543.56,317.5 508.63,317.5 508.63,363.22
R0_IS_N
  Top 0.61: CMP1.P$1 1023.62,150.5 1096.64,150.5 | 1096.64,150.5 1279.53,150.5 CMP55.P$5 | CMP14.P$1 1130.3,241.94 1096.64,241.94 1096.64,150.5
R1_IS_N
  Top 0.61: CMP52.P$3 1056.01,165.1 1019.81,165.1 | 1019.81,165.1 CMP52.P$7 | CMP1.P$2 1019.81,165.1 | CMP17.P$1 988.7,165.1 1019.81,165.1
RA_MUX_IS_N
  Top 0.61: CMP19.P$2 855.98,259.08 765.17,259.08 | 765.17,259.08 CMP16.P$2 | CMP4.P$3 342.9,238.76 765.17,238.76 | CMP15.P$1 784.86,158.75 765.17,158.75 765.17,238.76 | 765.17,238.76 765.17,259.08
RA_MUX_LSB
  Top 0.61: CMP23.P$2 825.5,255.27 735.33,255.27 735.33,128.27 777.24,128.27 | CMP59.P$2 1348.11,128.27 777.24,128.27 | CMP15.P$3 777.24,128.27
RIGHT_SHIFT_INPUT
  Top 0.61: CMP34.OUT_P 824.23,457.83 279.4,457.83 CMP65.P$15
ROT_LEFT_INPUT
  Top 0.61: CMP18.P$2 796.29,368.94 786.13,368.94 786.13,321.31 765.17,321.31 CMP16.OUT_P
ROT_RIGHT_INPUT
  Top 0.61: CMP34.P$3 CMP23.OUT_P
SHIFT_IS_SHIFTING
  Top 0.61: CMP59.P$1 1355.09,97.79 1189.36,97.79 CMP92.P$1
SHIFT_LEFT
  Top 0.61: CMP38.N 734.06,330.83 774.07,330.83 CMP36.P$1
SHIFT_RIGHT
  Top 0.61: CMP38.P CMP37.P$2
STATE_0
  Top 0.61: CMP55.P$9 1243.96,345.44 | 1243.96,345.44 1261.74,345.44 CMP55.P$7 | CMP55.P$11 1225.55,345.44 | 1225.55,345.44 1243.96,345.44 | CMP48.P$4 1119.51,142.88 | 1119.51,142.88 1137.92,142.88 | 1137.92,142.88 CMP48.P$2 | CMP14.P$4 1103.63,142.88 | 1103.63,142.88 1119.51,142.88 | 1225.55,345.44 1225.55,142.88 1137.92,142.88 | CMP12.P$1 904.24,142.88 1103.63,142.88
STATE_1
  Top 0.61: CMP24.P$1 286.38,133.35 | 286.38,133.35 635,133.35 | 635,133.35 CMP25.IN | CMP20.P$2 215.9,133.35 286.38,133.35 | 635,133.35 900.43,133.35 CMP12.P$2
STATE_1_N
  Top 0.61: CMP37.P$1 733.42,339.73 | 733.42,339.73 767.08,339.73 CMP36.P$2 | CMP25.N 638.81,339.73 | 638.81,339.73 733.42,339.73 | 638.81,339.73 CMP45.P$3
STATE_2
  Top 0.61: CMP12.P$3 896.62,139.7 1185.55,139.7 CMP56.P$3
STATE_3
  Top 0.61: CMP4.P$1 360.05,107.95 892.81,107.95 | 892.81,107.95 977.26,107.95 CMP17.P$3 | CMP12.P$4 892.81,107.95
STATE_6
  Top 0.61: CMP12.P$7 881.38,125.73 1229.99,125.73 1229.99,332.11 1189.36,332.11 CMP55.P$15
STATE_7
  Top 0.61: CMP47.P$1 978.53,255.27 963.93,255.27 963.93,161.93 | 963.93,161.93 1040.13,161.93 | 1040.13,161.93 1040.13,168.28 CMP52.P$5 | CMP55.P$14 1198.24,280.67 1210.94,280.67 1210.94,161.93 1040.13,161.93 | CMP12.P$8 877.57,161.93 963.93,161.93
STATE_10
  Top 0.61: 1157.61,346.07 1170.31,346.07 1170.31,415.93 1175.38,415.93 CMP67.P$8 | 1157.61,346.07 CMP62.1 | 1047.75,250.82 1075.06,250.82 1075.06,346.07 1157.61,346.07 | 1047.75,250.82 CMP50.2 | CMP12.P$11 866.14,165.1 966.47,165.1 966.47,250.82 1047.75,250.82
STATE_11
  Top 0.61: CMP12.P$12 862.33,118.11 | 862.33,118.11 1084.58,118.11 CMP60.3 | 862.33,118.11 128.91,118.11 128.91,353.69 135.89,353.69 CMP27.P$1
STATE_12
  Top 0.61: CMP12.P$13 858.52,115.57 1087.12,115.57 1087.12,369.57 1089.66,369.57 CMP60.2
STATE_13
  Top 0.61: 1135.38,368.94 1121.41,368.94 1121.41,421.64 1167.77,421.64 CMP67.P$6 | 1135.38,368.94 CMP62.5 | CMP27.P$2 128.27,369.57 | 128.27,369.57 161.29,369.57 CMP31.4 | CMP12.P$14 854.71,123.19 | 854.71,123.19 1010.28,123.19 | 1010.28,123.19 1099.82,123.19 1099.82,228.6 1145.54,228.6 1145.54,334.01 1135.38,334.01 1135.38,368.94 | CMP52.P$8 1010.28,123.19 | 854.71,123.19 125.73,123.19 125.73,369.57 128.27,369.57
STATE_14
  Top 0.61: CMP54.1 1047.12,360.68 1151.89,360.68 | 1151.89,360.68 CMP62.2 | 1122.05,244.47 1107.44,244.47 1107.44,135.89 1049.02,135.89 | 1122.05,244.47 1151.89,244.47 1151.89,360.68 | 1049.02,135.89 1049.02,168.28 CMP52.P$4 | 1049.02,135.89 850.9,135.89 CMP12.P$15 | CMP14.P$2 1122.05,244.47
STATE_15
  Top 0.61: CMP55.P$3 1297.94,345.44 1288.41,345.44 | 1288.41,345.44 CMP55.P$4 | 1288.41,345.44 1288.41,131.44 1287.78,130.81 847.09,130.81 CMP12.P$16
USE_ADD_V
  Top 0.61: CMP2.OUT_P 530.86,434.34 248.92,434.34 CMP65.P$7
USE_NEG_V
  Top 0.61: CMP9.OUT_P 598.17,439.42 256.54,439.42 CMP65.P$9
USE_SUB_V
  Top 0.61: CMP8.OUT_P 564.51,436.88 252.73,436.88 CMP65.P$8
X_ROT_INPUT
  Top 0.61: CMP34.P$2 831.22,364.49 803.91,364.49 | 803.91,364.49 CMP18.P$1 | CMP11.OUT_P 795.02,364.49 803.91,364.49
XOR
  Top 0.61: CMP44.OUT_M 509.27,421.64 237.49,421.64 CMP65.P$4
(copper drawn outside any net)
  shapes: Top circle x93

## Text on the board
tPlace: alu_operation_ctrl | alu_input_ctrl | adder_2_ctrl | sqrt_mask | Gather the signals that control ADDER2 / input and operation. | Gather the signals to control / the operation of the ALU / elements other than ADD2 | ALU Control | Gather the signals to control / the input stage of the ALU. | 0 | 0 | Here we generate the signals to direct the ALU to carry out the required / operations for the current instruction depending on what state we're in, / and sometimes also depending on status flags. | 0 | right_shift_input | left_shift_input | is_shifting_left | is_shifting_right | bit_select_enable | H_0 | H_1 | H_2 | H_3 | alu_x_mux_RA | alu_y_mux_k | alu_y_mux_RB | alu_y_mux_not_bit | alu_y_mux_bit | k_m | k_1 | input_carry_bit | H_4 | xor | or | and | add2_mux_weight | add2_y_mux_h | add2_y_mux_R0 | add2_y_mux_p1 | add2_x_mux_RI | alu_x_mux_shift_R3 | k_0 | use_add_v | use_sub_v | use_neg_v | alu_output_mux_adder | add2_x_mux_shift_R2 | add2_x_mux_PC | alu_output_mux_logic | add2_x_mux_sqrt_mask | add2_do_subtract | add2_carry_in | not used | not used | Decode H7:6 / to give BIT or / SHIFT mode | 0 | 1 | Generate increment for / construction of square root | 1 | not used | opcode_is_xor_group | opcode_is_or_group | opcode_is_mover | k_0 | adder_y_special | adder_x_special | ADD2_X_MUX_RI__SP | ADD2_X_MUX_RI__H | flag_F6 | flag_X | RA_mux_LSbit | RA_mux_is_n | opcode_is_cmp_group | k_m | k_1 | opcode_is_addq_group | opcode_is_stack_group | opcode_is_sub_group | opcode_is_inv | opcode_is_cmp | flag_F3 | H_7 | H_6 | H_4 | H_3 | H_2 | H_1 | H_0 | opcode_is_sqrt | opcode_is_div | opcode_is_abs | opcode_is_muls | opcode_is_addx | opcode_is_subx | opcode_is_negx | opcode_is_add_group | opcode_is_and_group | opcode_is_or | opcode_is_sub | opcode_is_bit_xx | opcode_is_neg | opcode_is_logic_group | opcode_is_shift_xx | opcode_is_bxx_state_2 | state_15 | state_14 | state_13 | state_12 | state_11 | state_10 | state_7 | state_6 | state_3 | state_2 | state_1 | state_0 | R1_is_n | R0_is_n | opcode_is_stack_rel_state_2 | opcode_is_add_sp_state_2 | opcode_is_jsr_abs | opcode_is_mul_n | opcode_is_move_r0_sp_state_0 | opcode_is_jmp_r0 | opcode_is_move_sp_r0 | opcode_is_indirect_postinc | opcode_is_jsr_x_state_7 | opcode_is_div_state_0 | opcode_is_trap | opcode_is_jsr_r0 | opcode_is_push_ra | opcode_is_push_ps | opcode_is_divs_state_0 | shift_is_shifting | opcode_is_bit_xx_n | decode_for_alu(2) | state | PS | H | Rn_arith_flags | decode_for_alou(0) | rnx_specials | decode_for / _alu(1) | RA_flags